# EAGLE schematic H-API_AMP (EAGLE 9.1.3)
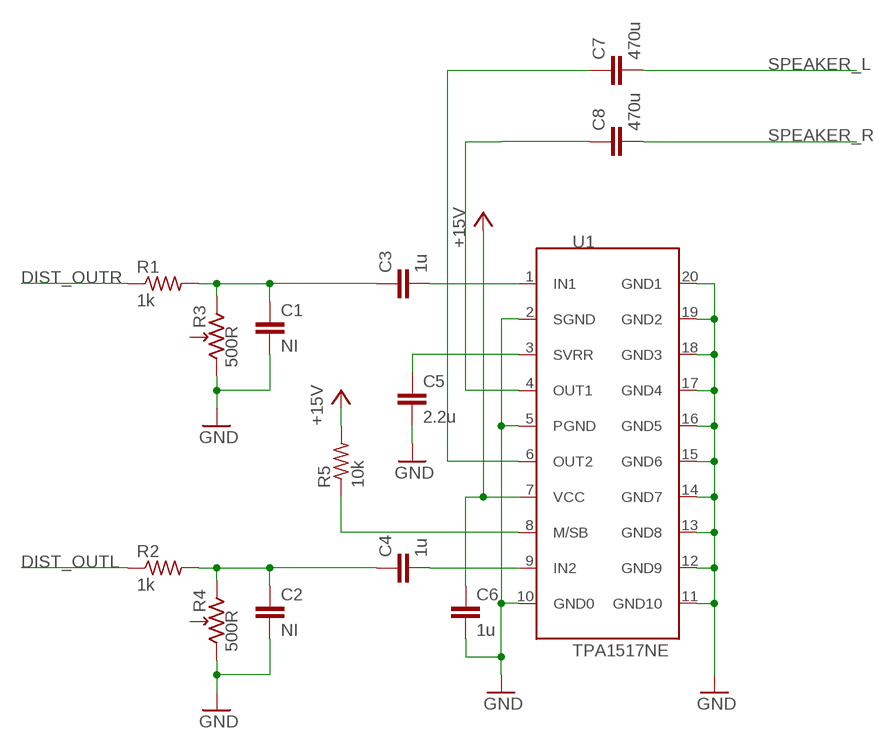
[diagram p0: schematic, sheet 1]

## Parts
C1  NI  C-EUC0805  [C0805]
C2  NI  C-EUC0805  [C0805]
C3  1u  C-EUC0805  [C0805]
C4  1u  C-EUC0805  [C0805]
C5  2.2u  C-EUC0805  [C0805]
C6  1u  C-EUC0805  [C0805]
C7  470u  C-EUC0805  [C0805]
C8  470u  C-EUC0805  [C0805]
R1  1k  R-US_VMTA55  [VMTA55]
R2  1k  R-US_VMTA55  [VMTA55]
R3  500R  TRIM-POT  [CT6]
R4  500R  TRIM-POT  [CT6]
R5  10k  R-US_VTA55  [VTA55]
U1  TPA1517NE  [DIP20]

## Nets
+5V: C6.1 R5.2 U1.7(VCC) ; supply symbol labelled +15V
DIST_OUTL: R2.1
DIST_OUTR: R1.1
GND: C1.2 C2.2 C5.2 C6.2 R3.A R4.A U1.2(SGND) U1.5(PGND) U1.10(GND0) U1.11(GND10) U1.12(GND9) U1.13(GND8) U1.14(GND7) U1.15(GND6) U1.16(GND5) U1.17(GND4) U1.18(GND3) U1.19(GND2) U1.20(GND1)
N$1: C1.1 C3.1 R1.2 R3.E
N$2: C2.1 C4.1 R2.2 R4.E
N$3: C3.2 U1.1(IN1)
N$4: C4.2 U1.9(IN2)
N$5: C5.1 U1.3(SVRR)
N$6: C8.1 U1.4(OUT1)
N$7: R5.1 U1.8(M/SB)
N$8: C7.1 U1.6(OUT2)
SPEAKER_L: C7.2
SPEAKER_R: C8.2
Unconnected: R3.S R4.S

## Library data of the parts
C1 C2 = resistor:C-EU: CAPACITOR, European symbol
C3-C8 = rcl:C-EU: CAPACITOR, European symbol; SPICEPREFIX: C
R1 R2 R5 = rcl:R-US_: RESISTOR, American symbol; SPICEPREFIX: R
R3 R4 = CapstoneLib:TRIM-POT
U1 = CapstoneLib:TPA1517NE